# EAGLE design V4 (EAGLE 6.4)
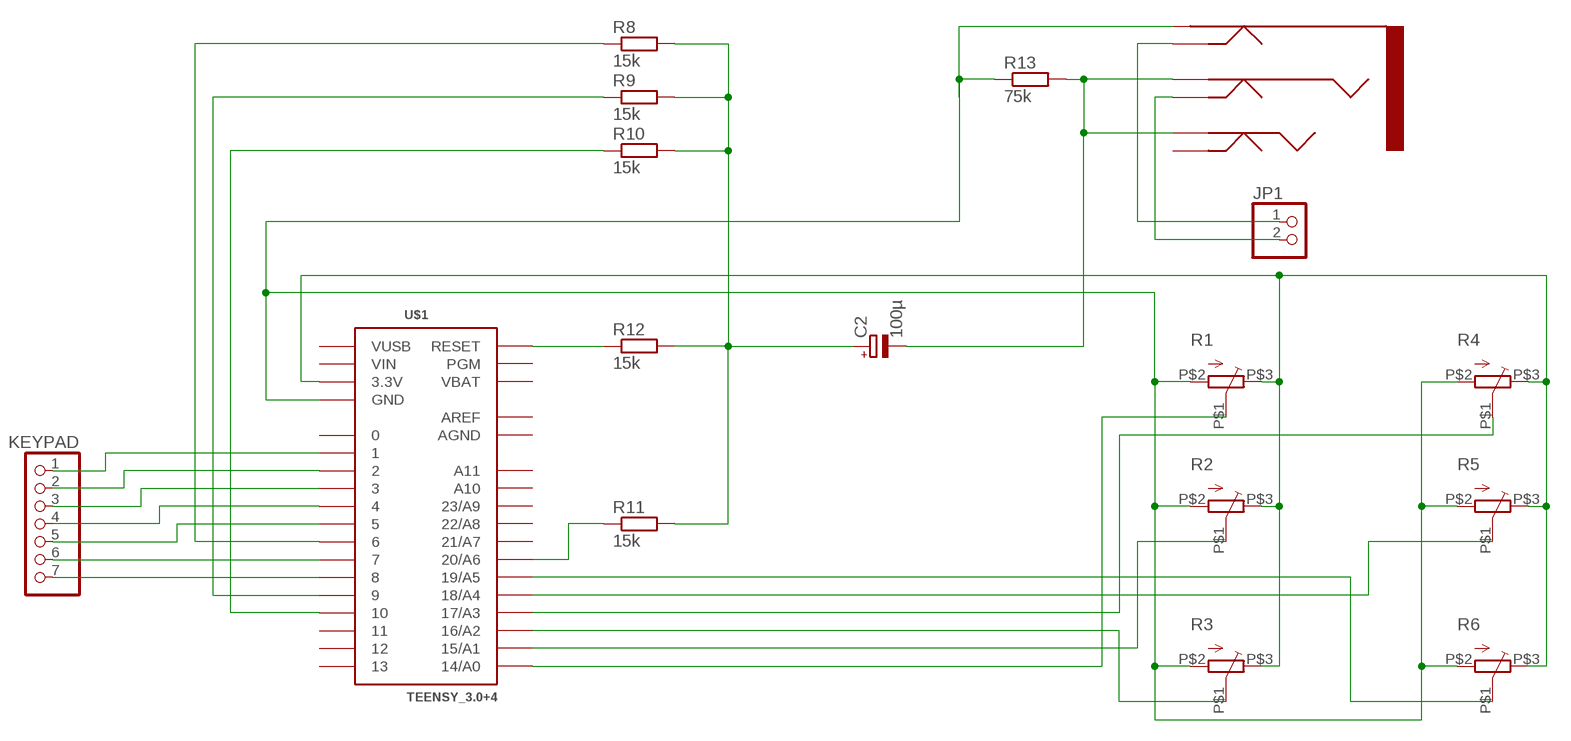
[diagram p0: schematic, sheet 1]

## Parts
C2  100µ  CPOL-EUE2.5-6  [E2,5-6]
JP1  PINHD-1X2  [1X02]
KEYPAD  PINHD-1X7  [1X07]
R1  STR09K113  [STR09K113]
R2  STR09K113  [STR09K113]
R3  STR09K113  [STR09K113]
R4  STR09K113  [STR09K113]
R5  STR09K113  [STR09K113]
R6  STR09K113  [STR09K113]
R8  15k  R-EU_0309/12  [0309/12]
R9  15k  R-EU_0309/12  [0309/12]
R10  15k  R-EU_0309/12  [0309/12]
R11  15k  R-EU_0309/12  [0309/12]
R12  15k  R-EU_0309/12  [0309/12]
R13  75k  R-EU_0309/12  [0309/12]
U$1  TEENSY_3.0+4  [TEENSY_3.0+4]
U$2  CLIF_3_5  [CLIFF_3-5M]

## Nets
GND: R1.P$2(S) R2.P$2(S) R3.P$2(S) R4.P$2(S) R5.P$2(S) R6.P$2(S) R13.1 U$1.GND U$1.GND1(GND) U$2.GROUND
N$1: R1.P$1(W) U$1.14/A0
N$2: R2.P$1(W) U$1.15/A1
N$3: R3.P$1(W) U$1.16/A2
N$4: R4.P$1(W) U$1.17/A3
N$5: R5.P$1(W) U$1.18/A4
N$6: R6.P$1(W) U$1.19/A5
N$7: KEYPAD.5 U$1.5
N$8: R1.P$3(E) R2.P$3(E) R3.P$3(E) R4.P$3(E) R5.P$3(E) R6.P$3(E) U$1.3.3V U$1.3.3V1(3.3V)
N$9: C2.- R13.2 U$2.RING U$2.TIP
N$10: KEYPAD.4 U$1.4
N$11: KEYPAD.3 U$1.3
N$12: KEYPAD.2 U$1.2
N$13: R8.1 U$1.6
N$14: KEYPAD.6 U$1.7
N$15: KEYPAD.7 U$1.8
N$16: KEYPAD.1 U$1.1
N$17: JP1.1 U$2.GROUND1
N$18: JP1.2 U$2.RING1
N$22: R9.1 U$1.9
N$23: R10.1 U$1.10
N$26: R12.1 U$1.RESET
N$29: R11.1 U$1.20/A6
N$31: C2.+ R8.2 R9.2 R10.2 R11.2 R12.2
Unconnected: U$1.0 U$1.11 U$1.12 U$1.13 U$1.21/A7 U$1.22/A8 U$1.23/A9 U$1.A10 U$1.A11 U$1.PGM U$2.TIP1

## Power pins joined to a net without a drawn wire
AGND: U$1.AGND
AREF: U$1.AREF
VBAT: U$1.VBAT
VIN: U$1.VIN
VUSB: U$1.VUSB

## Library data of the parts
C2 = rcl:CPOL-EU: POLARIZED CAPACITOR, European symbol
JP1 = pinhead:PINHD-1X2: PIN HEADER
KEYPAD = pinhead:PINHD-1X7: PIN HEADER
R1-R6 = anyma-lib:STR09K113: Alps Potentiometer
R8-R13 = resistor:R-EU_: RESISTOR, European symbol
U$1 = Teensy3.0:TEENSY_3.0+4: Teensy 3.0 board, showing all pins that are easily acessible. See 'AllAnalogPins" and 'AllPins' packages for additional pin holes, as needed. The 'Basic' package has fewer pins.
U$2 = tillo:CLIF_3_5: Cliff Jack 3.5mm FCR1295

## Board
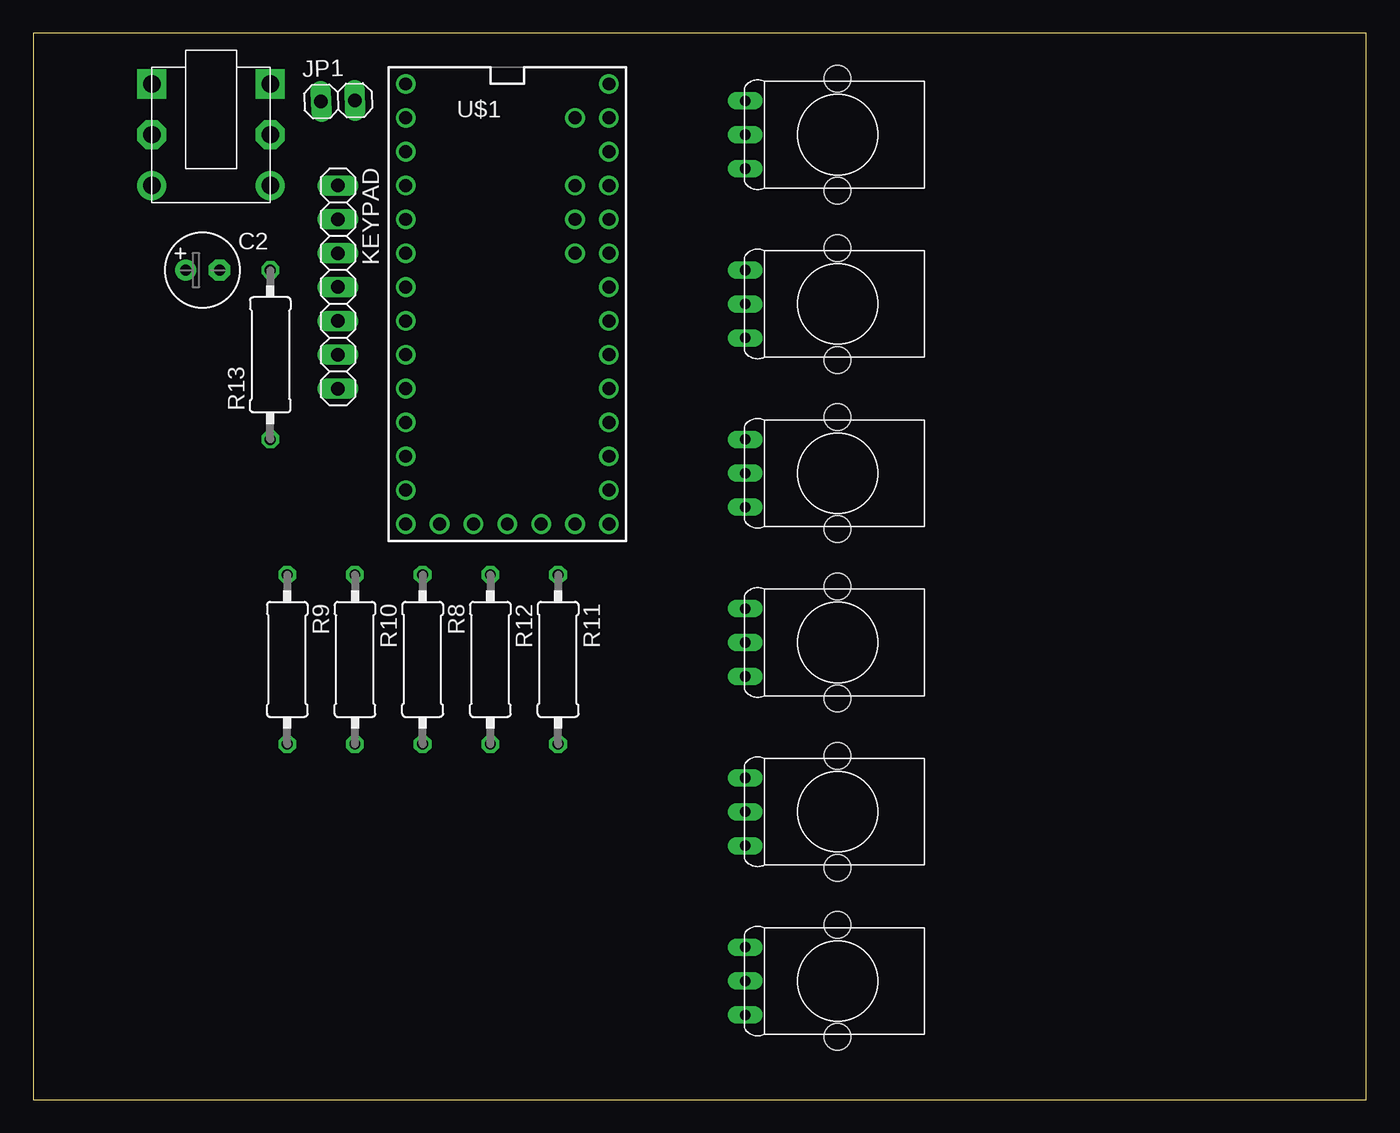
[diagram p1: board, top side]
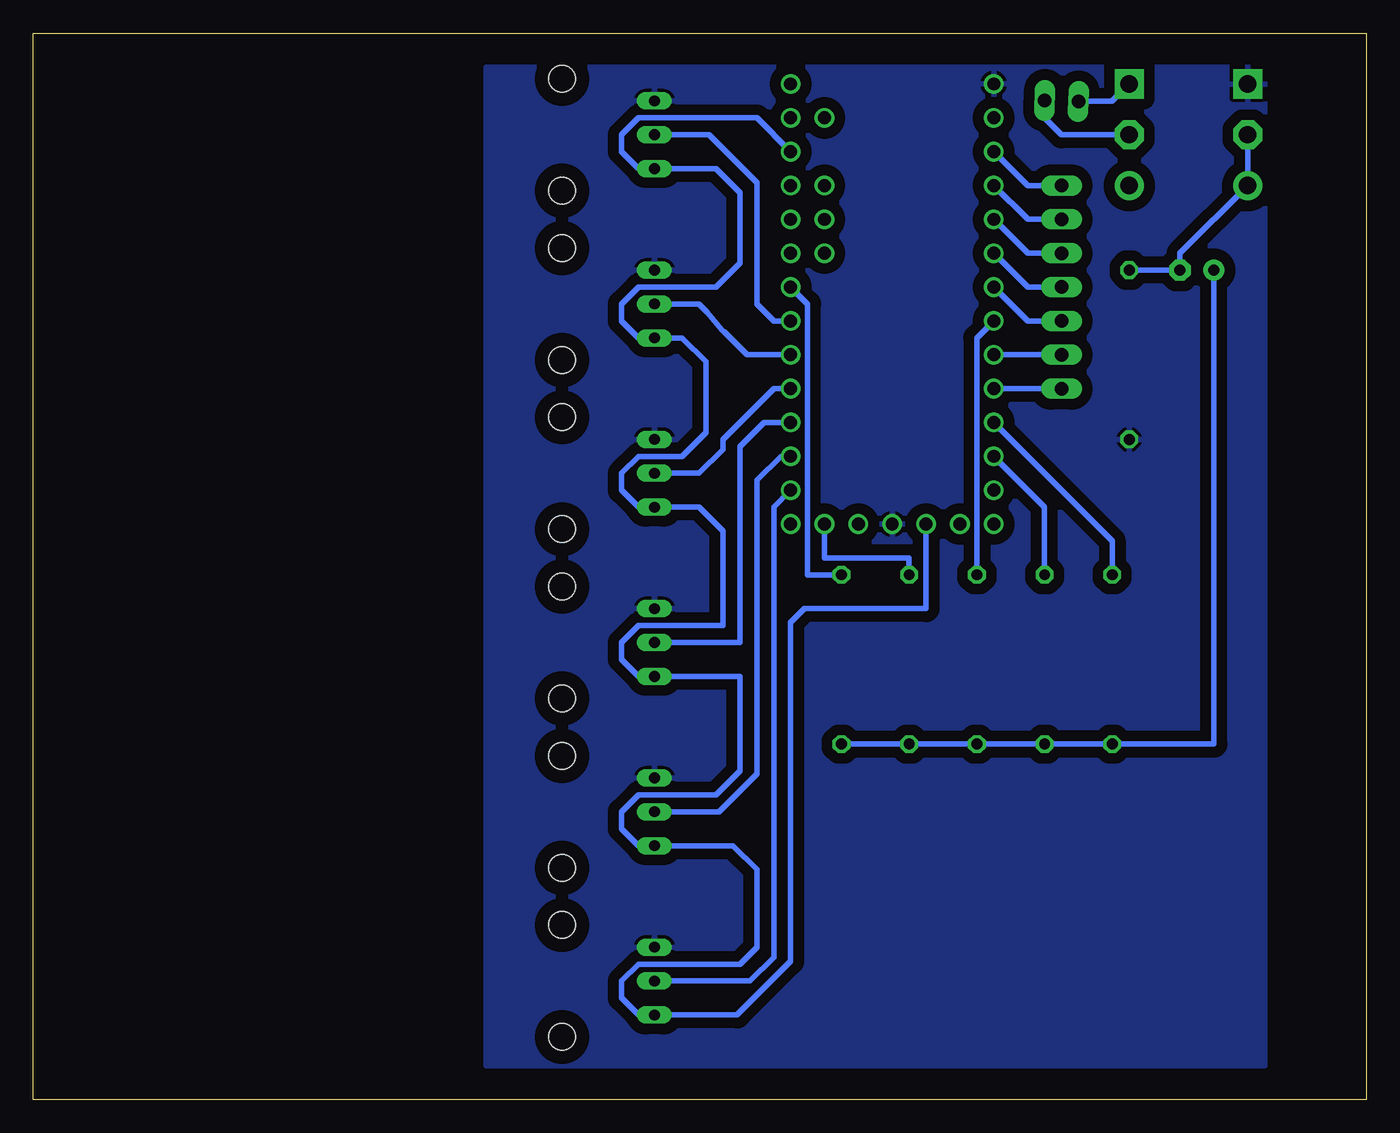
[diagram p2: board, bottom side, seen from below]

Size 100 x 80 mm. Coordinates in mm from the lower left corner, seen from the top.
Outline: 0,0 100,0 100,80 0,80 0,0
Copper layers (1*16): Top 0.035mm / dielectric 1.5mm / Bottom 0.035mm
Design rules "default *": minimum track width 10mil, minimum drill 24mil, track to track 32mil, track to pad 32mil, pad to pad 32mil, via to via 32mil, smd to smd 32mil, copper to edge 40mil, drill to drill 8mil, minimum pad ring 10mil, minimum via ring 8mil, stop-mask expansion 4mil, vias tented up to drill 0mil, thermal gap 10mil

### Footprints (pad centres in the part's own frame; a part is rotated, then mirrored left to right if it is on the bottom)
E2,5-6 = drill 0.813 pad 1.6: + -1.27,0 | drill 0.813 pad 1.6 octagon: - 1.27,0
1X02 = drill 1.016 long: 1 -1.27,0; 2 1.27,0
1X07 = drill 1.016 long: 1 -7.62,0; 2 -5.08,0; 3 -2.54,0; 4 0,0; 5 2.54,0; 6 5.08,0; 7 7.62,0
STR09K113 = drill 0.8 long: P$1 0,0.06; P$2 -2.54,0.06; P$3 2.54,0.06 | hole 2: -4.2,7; 4.2,7
0309/12 = drill 0.813 octagon: 1 -6.35,0; 2 6.35,0
TEENSY_3.0+4 = drill 0.965: 0 -7.62,13.97; 1 -7.62,11.43; 2 -7.62,8.89; 3 -7.62,6.35; 3.3V 7.62,11.43; 3.3V1 -2.54,-16.51; 4 -7.62,3.81; 5 -7.62,1.27; 6 -7.62,-1.27; 7 -7.62,-3.81; 8 -7.62,-6.35; 9 -7.62,-8.89; 10 -7.62,-11.43; 11 -7.62,-13.97; 12 -7.62,-16.51; 13 7.62,-16.51; 14/A0 7.62,-13.97; 15/A1 7.62,-11.43; 16/A2 7.62,-8.89; 17/A3 7.62,-6.35; 18/A4 7.62,-3.81; 19/A5 7.62,-1.27; 20/A6 7.62,1.27; 21/A7 7.62,3.81; 22/A8 7.62,6.35; 23/A9 7.62,8.89; A10 5.08,6.35; A11 5.08,3.81; AGND 7.62,13.97; AREF 5.08,8.89; GND -7.62,16.51; GND1 0,-16.51; PGM 2.54,-16.51; RESET 5.08,-16.51; VBAT -5.08,-16.51; VIN 7.62,16.51; VUSB 5.08,13.97
CLIFF_3-5M = drill 1.3 pad 2.184 square: GROUND 0,7.62; GROUND1 8.89,7.62 | drill 1.3 pad 2.184 octagon: RING 0,3.81; RING1 8.89,3.81 | drill 1.3 pad 2.184: TIP 0,0; TIP1 8.89,0

### Placement (x,y rotation side)
C2  12.7,62.23 0 top
JP1  22.86,74.93 1.8 top
KEYPAD  22.86,60.96 270 top
R1  53.34,8.89 270 top
R2  53.34,21.59 270 top
R3  53.34,34.29 270 top
R4  53.34,46.99 270 top
R5  53.34,59.69 270 top
R6  53.34,72.39 270 top
R8  29.21,33.02 270 top
R9  19.05,33.02 270 top
R10  24.13,33.02 270 top
R11  39.37,33.02 270 top
R12  34.29,33.02 270 top
R13  17.78,55.88 90 top
U$1  35.56,59.69 0 top
U$2  8.89,68.58 0 top

### Tracks (layer width: path | path; a pad name or v marks a point on that pad's centre or on a via)
GND
  pour Bottom: 7.62,77.47 66.04,77.47 66.04,2.54 7.62,2.54
N$1
  Bottom 0.406: U$1.14/A0 44.45,44.45 44.45,10.69 46.25,8.89 R1.P$1
N$2
  Bottom 0.406: U$1.15/A1 43.92,48.26 45.72,46.46 45.72,24.43 48.56,21.59 R2.P$1
N$3
  Bottom 0.406: R3.P$1 46.99,34.29 46.99,49 45.19,50.8 U$1.16/A2
N$4
  Bottom 0.406: R4.P$1 50.06,46.99 48.26,48.79 48.26,49.53 44.45,53.34 U$1.17/A3
N$5
  Bottom 0.406: R5.P$1 50.06,59.69 49.6,59.24 49.46,59.09 48.32,57.75 48.19,57.61 46.46,55.88 U$1.18/A4
N$6
  Bottom 0.406: R6.P$1 49.31,72.39 45.72,68.8 45.72,59.69 44.45,58.42 U$1.19/A5
N$7
  Bottom 0.406: U$1.5 25.4,58.42 KEYPAD.5
N$8
  Bottom 0.406: U$1.3.3V1 33.02,36.83 42.13,36.83 43.18,35.78 43.18,10.37 47.2,6.35 R1.P$3 54.61,6.35 55.88,7.62 55.88,8.89 54.61,10.16 46.99,10.16 45.72,11.43 45.72,17.25 47.52,19.05 R2.P$3 54.61,19.05 55.88,20.32 55.88,21.59 54.61,22.86 48.79,22.86 46.99,24.66 46.99,31.75 R3.P$3 54.61,31.75 55.88,33.02 55.88,34.29 54.61,35.56 48.26,35.56 48.26,42.65 50.06,44.45 R4.P$3 54.61,44.45 55.88,45.72 55.88,46.99 54.61,48.26 51.33,48.26 49.53,50.06 49.53,55.35 51.33,57.15 R5.P$3 54.61,57.15 55.88,58.42 55.88,59.69 54.61,60.96 48.79,60.96 46.99,62.76 46.99,68.05 48.79,69.85 R6.P$3 54.61,69.85 55.88,71.12 55.88,72.39 54.61,73.66 45.72,73.66 U$1.3.3V
N$9
  Bottom 0.406: R13.2 C2.- 13.97,63.5 U$2.TIP U$2.RING
N$10
  Bottom 0.406: U$1.4 25.4,60.96 KEYPAD.4
N$11
  Bottom 0.406: U$1.3 25.4,63.5 KEYPAD.3
N$12
  Bottom 0.406: U$1.2 25.4,66.04 KEYPAD.2
N$13
  Bottom 0.406: R8.1 29.21,57.15 U$1.6
N$14
  Bottom 0.406: KEYPAD.6 U$1.7
N$15
  Bottom 0.406: KEYPAD.7 U$1.8
N$16
  Bottom 0.406: U$1.1 25.4,68.58 KEYPAD.1
N$17
  Bottom 0.406: 21.55,74.93 JP1.1 19.09,74.89 U$2.GROUND1
N$18
  Bottom 0.406: JP1.2 24.13,73.66 22.86,72.39 U$2.RING1
N$22
  Bottom 0.406: U$1.9 19.05,41.91 R9.1
N$23
  Bottom 0.406: R10.1 24.13,44.45 U$1.10
N$26
  Bottom 0.406: R12.1 34.29,40.64 40.64,40.64 U$1.RESET
N$29
  Bottom 0.406: R11.1 41.91,39.37 41.91,59.69 U$1.20/A6
N$31
  Bottom 0.406: R8.2 R9.2 | R9.2 R10.2 R8.2 | R8.2 R12.2 R11.2 | R9.2 11.43,26.67 C2.+